# EAGLE board ESP32-Adapter_V101 (EAGLE 9.5.2)
DATUM: 05/2021; VERSION: V1.0.1
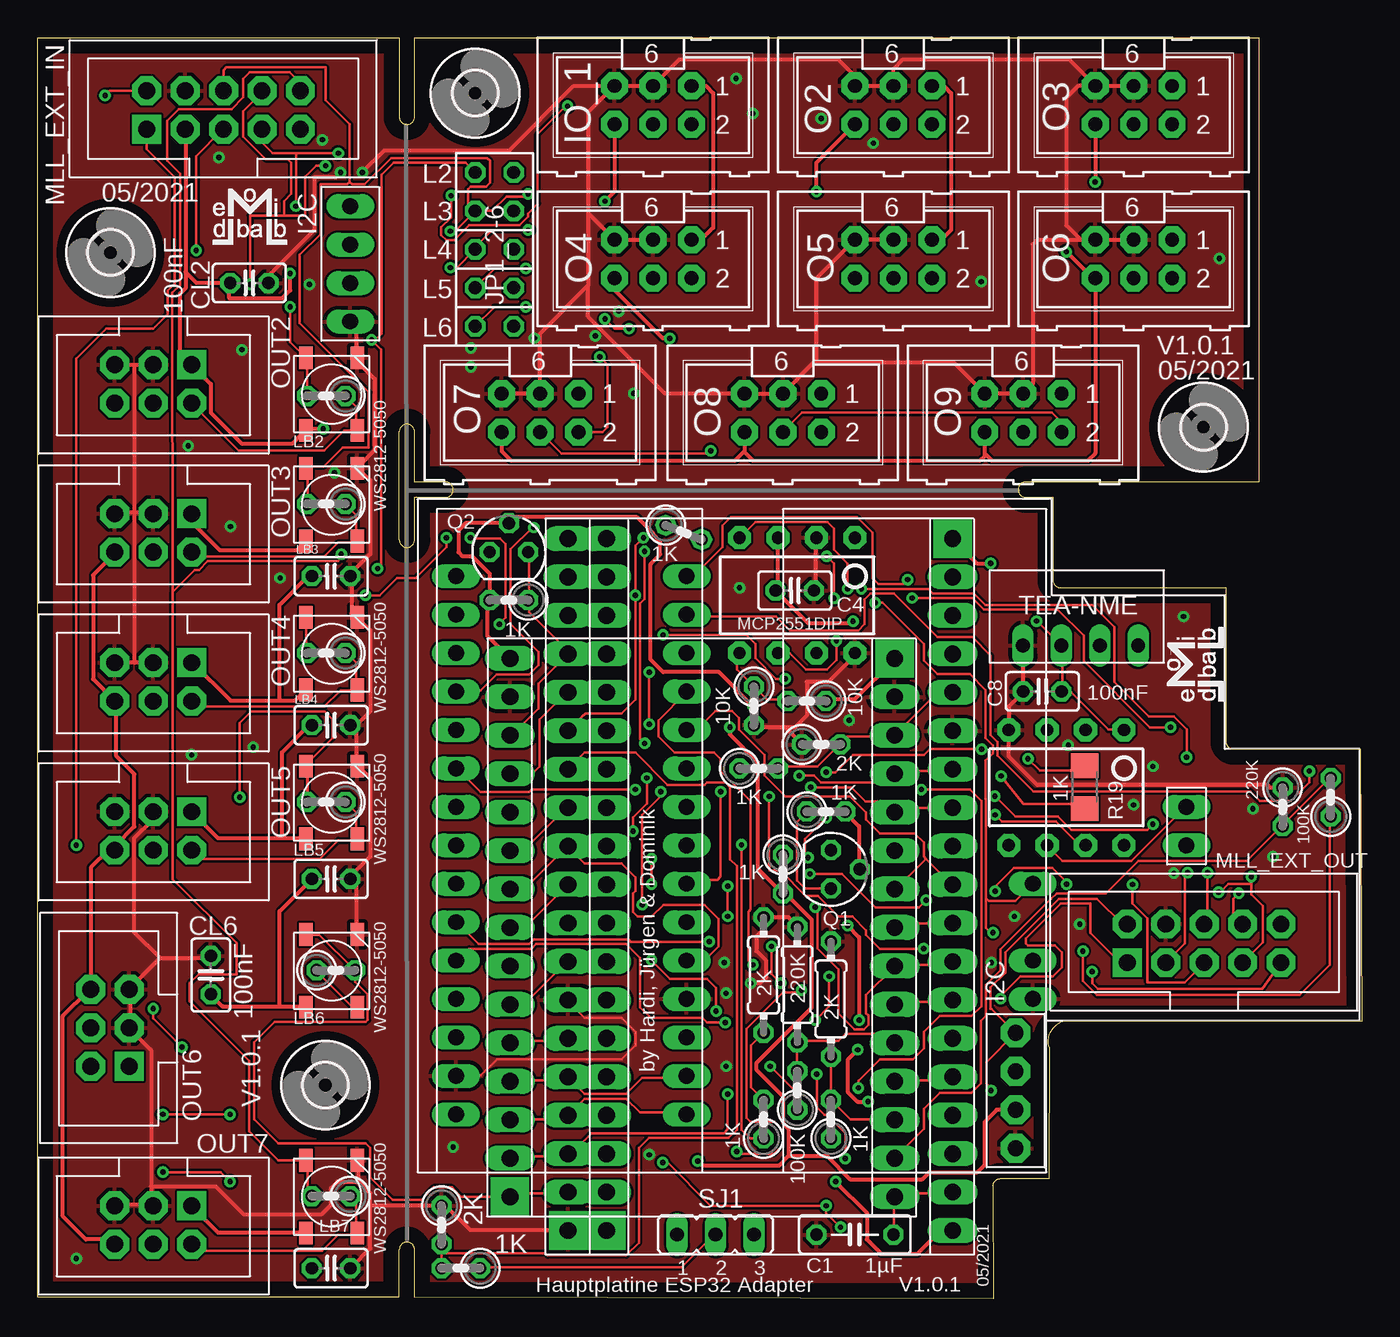
[diagram p2: board, top side]
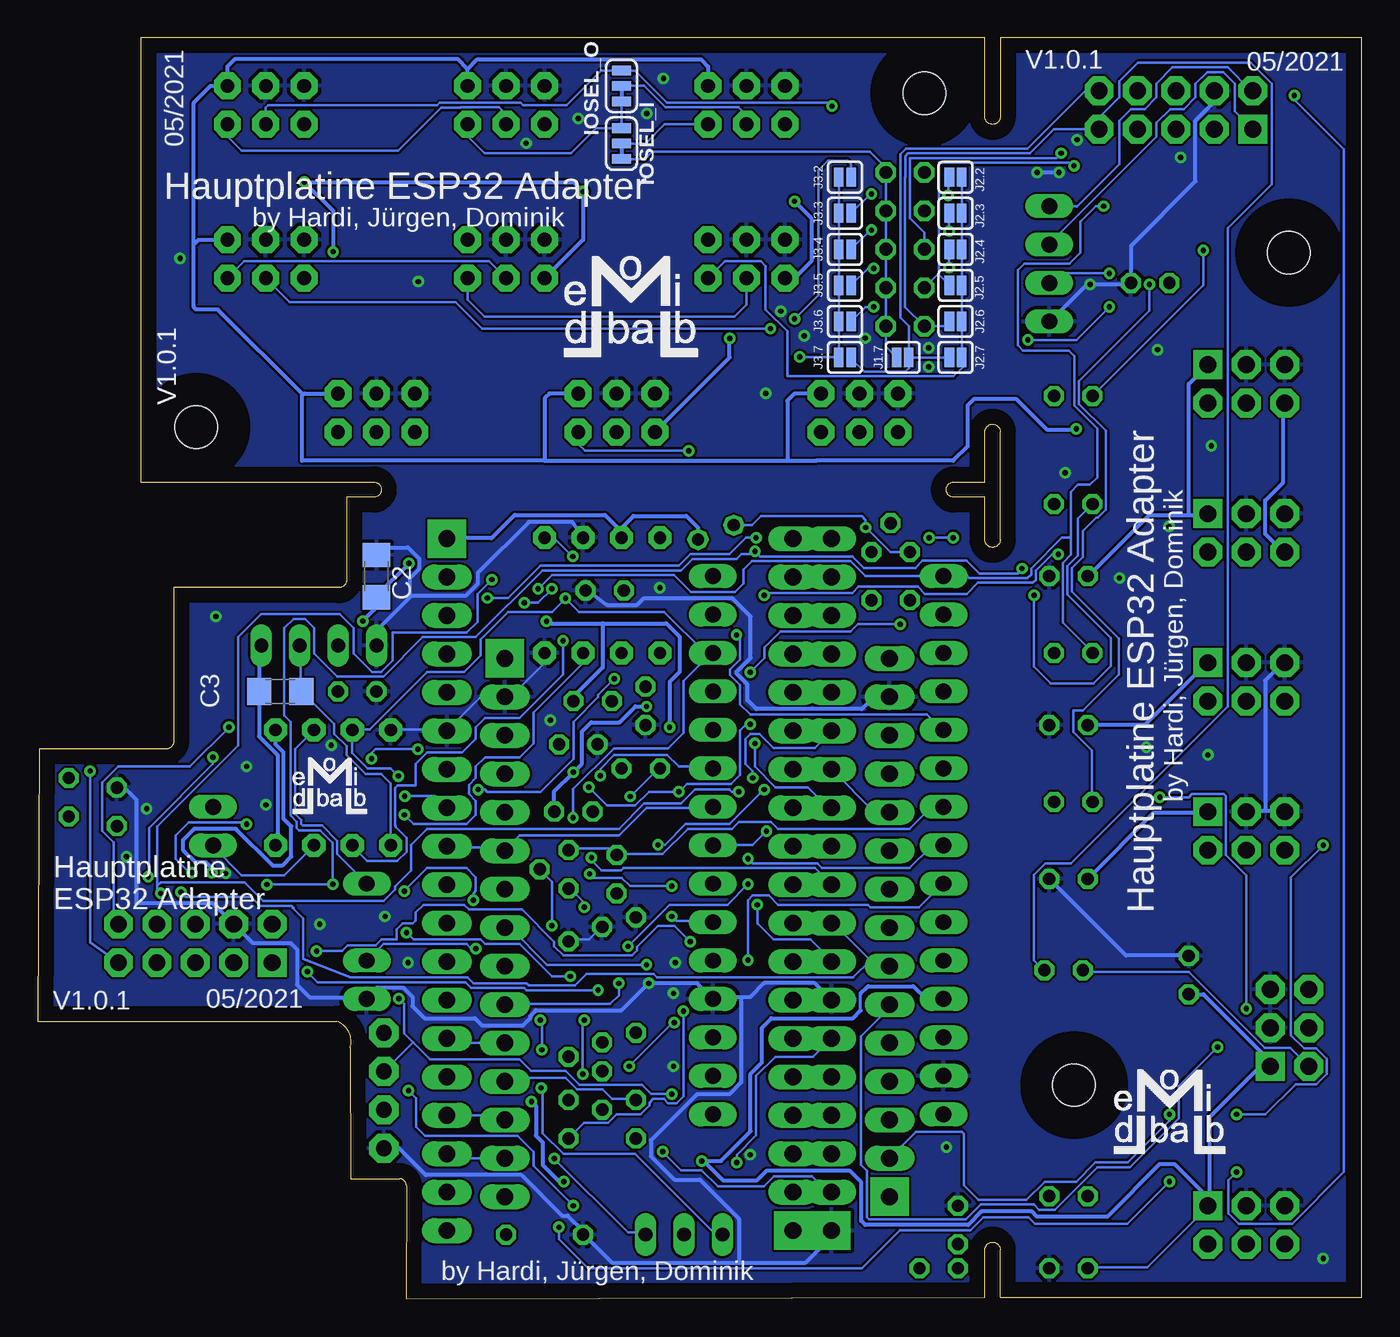
[diagram p3: board, bottom side, seen from below]

Size 87.45 x 83.31 mm. Coordinates in mm from the lower left corner, seen from the top.
Outline: 0,0.13 0,83.31 23.88,83.31 23.88,78.1 arc180 24.89,78.1 24.89,83.31 80.64,83.31 80.64,53.98 65.27,53.98 arc180 65.27,52.96 67.06,52.96 67.06,47.5 arc90 67.56,46.99 78.49,46.99 78.49,36.83 arc90 78.99,36.32 87.38,36.32 87.45,18.34 67.72,18.34 arc90 66.83,16.61 66.8,7.95 63.56,7.95 arc90 63.11,7.47 63.12,0 24.89,0.13 24.89,3.25 arc180 23.88,3.25 23.88,0.13 0,0.13
Outline: 23.88,50.16 arc180 24.89,50.16 24.89,52.96 26.93,52.96 arc180 26.93,53.98 24.89,53.98 24.89,57.29 arc180 23.88,57.29 23.88,50.16
Copper layers (1*16): Top 0.035mm / dielectric 1.5mm / Bottom 0.035mm
Design rules "default *": minimum track width 6mil, minimum drill 0.35mm, track to track 6mil, track to pad 6mil, pad to pad 6mil, via to via 6mil, smd to smd 6mil, copper to edge 40mil, drill to drill 6mil, minimum pad ring 10mil, minimum via ring 8mil, stop-mask expansion 4mil, vias tented up to drill 0.5mm, thermal gap 10mil

## Footprints (pad centres in the part's own frame; a part is rotated, then mirrored left to right if it is on the bottom)
C050-025X075 = drill 0.813 octagon: 1 -2.54,0; 2 2.54,0
C1206 = smd 1.6 x 1.8: 1 -1.4,0; 2 1.4,0
C025-025X050 = drill 0.813 octagon: 1 -1.27,0; 2 1.27,0
2,8 = hole 2.8: 0,0
DIP08 = drill 0.813 pad 1.524 octagon: 1 -3.81,-3.81; 2 -1.27,-3.81; 3 1.27,-3.81; 4 3.81,-3.81; 5 3.81,3.81; 6 1.27,3.81; 7 -1.27,3.81; 8 -3.81,3.81
ML6 = drill 0.914 pad 1.778 octagon: 1 -2.54,-1.27; 2 -2.54,1.27; 3 0,-1.27; 4 0,1.27; 5 2.54,-1.27; 6 2.54,1.27
SMT-JUMPER_3_1-NC_TRACE_SILK = smd 0.635 x 1.27: 1 -1.016,0; 2 0,0; 3 1.016,0
SMT-JUMPER_2_NO_SILK = smd 0.635 x 1.27: 1 -0.406,0; 2 0.406,0
5XJUMPER_L = drill 0.85 pad 1.27 octagon: P$1 -1.27,5.08; P$2 1.27,5.08; P$3 -1.27,2.54; P$4 1.27,2.54; P$5 -1.27,0; P$6 1.27,0; P$7 -1.27,-2.54; P$8 1.27,-2.54; P$9 -1.27,-5.08; P$10 1.27,-5.08
5050 = smd 1.5 x 0.9: DI 2.36,1.66; DO -2.44,-1.74; GND 2.36,-1.74; VCC -2.44,1.66
IDC10 = drill 1.1 pad 1.9 square: 1 -5.08,-1.27 | drill 1.1 pad 1.9 octagon: 2 -5.08,1.27; 3 -2.54,-1.27; 4 -2.54,1.27; 5 0,-1.27; 6 0,1.27; 7 2.54,-1.27; 8 2.54,1.27; 9 5.08,-1.27; 10 5.08,1.27
IDC6 = drill 1.1 pad 1.9 octagon: D1 -2.54,1.27; D2 0,1.27; GND 0,-1.27; GND2 2.54,-1.27; VCC2 2.54,1.27 | drill 1.1 pad 1.9 square: VCC -2.54,-1.27
SOT54E = drill 0.813 octagon: D -1.27,0; G 0,1.905; S 1.27,0
0207/2V = drill 0.813 octagon: 1 -1.27,0; 2 1.27,0
0204/7 = drill 0.813 octagon: 1 -3.81,0; 2 3.81,0
R1206 = smd 1.6 x 1.803: 1 -1.422,0; 2 1.422,0
JP2 = drill 0.914 long: 1 -2.54,0; 2 0,0; 3 2.54,0
ESP32-38D_0 = drill 1.1 pad 1.45 long: CLK 26.887,1.33; CLK-1 24.347,1.33; D0 26.887,14.03; D0-1 24.347,14.03; D2 26.887,11.49; D2-0 24.347,11.49; D4 26.887,16.57; D4-1 24.347,16.57; D5 26.887,24.19; D5-1 24.347,24.19; D12 1.487,16.57; D13 1.487,11.49; D14 1.487,19.11; D15 26.887,8.95; D15-1 24.347,8.95; D16 26.887,19.11; D16-1 24.347,19.11; D17 26.887,21.65; D17-1 24.347,21.65; D18 26.887,26.73; D18-1 24.347,26.73; D19 26.887,29.27; D19-1 24.347,29.27; D21 26.887,34.35; D21-1 24.347,34.35; D22 26.887,41.97; D22-1 24.347,41.97; D23 26.887,44.51; D23-1 24.347,44.51; D25 1.487,26.73; D26 1.487,24.19; D27 1.487,21.65; D32 1.487,31.81; D33 1.487,29.27; D34 1.487,36.89; D35 1.487,34.35; EN 1.487,44.51; GND 1.487,14.03; GND_2 26.887,31.81; GND_2-1 24.347,31.81; RX0 26.887,36.89; RX0-1 24.347,36.89; SD0-1 24.347,3.87; SD1 26.887,6.41; SD1-1 24.347,6.41; SD2 1.487,8.95; SD3 1.487,6.41; SDO 26.887,3.87; TX0 26.887,39.43; TX0-1 24.347,39.43; VCC_2 1.487,47.05; VN 1.487,39.43; VP 1.487,41.97 | drill 1.1 pad 1.27 long: CMD 1.487,3.87 | drill 1.1 pad 2.54 square: GND_3 26.887,47.05; GND_3-1 24.347,47.05; VCC_1 1.487,1.33
ESP32-30_0 = drill 1.1 pad 1.45 long: D2 26.91,8.931; D4 26.91,11.471; D5 26.91,19.091; D12 1.51,8.931; D13 1.51,6.391; D14 1.51,11.471; D15 26.91,6.391; D18 26.91,21.631; D19 26.91,24.171; D21 26.91,26.711; D22 26.91,34.331; D25 1.51,19.091; D26 1.51,16.551; D27 1.51,14.011; D32 1.51,24.171; D33 1.51,21.631; D34 1.51,29.251; D35 1.51,26.711; EN 1.51,36.871; GND 1.51,3.851; GND_2 26.91,3.851; RX0 26.91,29.251; RX2 26.91,14.011; TX0 26.91,31.791; TX2 26.91,16.551; VCC_2 26.91,1.311; VN 1.51,31.791; VP 1.51,34.331 | drill 1.1 pad 2.54 square: D23 26.91,36.871; VCC_1 1.51,1.311
MLL-100-1.2NANOS_CAN = drill 1.05 long: 3V3 1.27,36.83; 5V 1.27,11.43; A0 1.27,31.75; A1 1.27,29.21; A2 1.27,26.67; A3 1.27,24.13; A4 1.27,21.59; A5 1.27,19.05; A6 1.27,16.51; A7 1.27,13.97; AREF 1.27,34.29; CAN_H 49.53,21.59; CAN_L 49.53,24.13; D2 16.51,13.97; D3 16.51,16.51; D4 16.51,19.05; D5 16.51,21.59; D6 16.51,24.13; D7 16.51,26.67; D8 16.51,29.21; D9 16.51,31.75; D10 16.51,34.29; D11 16.51,36.83; D12 16.51,39.37; D13 1.27,39.37; DCC_D2 39.37,13.97; DCC_D4 39.37,19.05; DCC_GND1 39.37,11.43; GND 1.27,6.35; GND1 16.51,11.43; RST 1.27,8.89; RST1 16.51,8.89; RX0 16.51,6.35; TX1 16.51,3.81; VIN 1.27,3.81
I2C-4S = drill 1.05 pad 1.93 octagon: GND 0,-3.81; SCL 0,1.27; SDA 0,3.81; VCC 0,-1.27
DCDC-TEA_NME = drill 0.9 long: G_IN 2.21,1.13; G_OUT 7.29,1.13; V_IN 4.75,1.13; V_OUT 9.83,1.13
I2C-4 = drill 1.05 long: GND 0,-3.81; SCL 0,1.27; SDA 0,3.81; VCC 0,-1.27

## Placement (x,y rotation side)
C1  1µF  [C050-025X075]  53.98,4.25 180 top
C2  4,7µF  [C1206]  65.09,47.75 270 bottom
C3  4,7µF  [C1206]  71.44,40.13 180 bottom
C4  100nF  [C025-025X050]  50.01,46.8 180 top
C8  100nF  [C025-025X050]  66.36,40.13 0 top
CL2  100nF  [C025-025X050]  13.97,67.12 180 top
CL3  100nF  [C025-025X050]  19.37,47.75 180 top
CL4  100nF  [C025-025X050]  19.37,37.91 180 top
CL5  100nF  [C025-025X050]  19.37,27.75 180 top
CL6  100nF  [C025-025X050]  11.43,21.4 270 top
CL7  100nF  [C025-025X050]  19.37,2.03 180 top
H1  MOUNT-HOLE2.8  [2,8]  4.8,69.13 0 top
H2  MOUNT-HOLE2.8  [2,8]  19,14.13 0 top
H3  MOUNT-HOLE2.8  [2,8]  28.89,79.66 0 top
H4  MOUNT-HOLE2.8  [2,8]  76.99,57.59 0 top
IC1  ISO1050  [DIP08]  67.94,33.78 180 top
IO_1  [ML6]  40.64,78.87 180 top
IOSEL_I  JUMPER-SMT_3_1-NC_TRACE_SILK  [SMT-JUMPER_3_1-NC_TRACE_SILK]  48.9,76.33 270 bottom
IOSEL_O  JUMPER-SMT_3_1-NC_TRACE_SILK  [SMT-JUMPER_3_1-NC_TRACE_SILK]  48.9,80.14 270 bottom
J1.7  JUMPER-SMT_2_NO_SILK  [SMT-JUMPER_2_NO_SILK]  30.32,62.2 180 bottom
J2.2  JUMPER-SMT_2_NO_SILK  [SMT-JUMPER_2_NO_SILK]  26.83,74.1 0 bottom
J2.3  JUMPER-SMT_2_NO_SILK  [SMT-JUMPER_2_NO_SILK]  26.83,71.72 0 bottom
J2.4  JUMPER-SMT_2_NO_SILK  [SMT-JUMPER_2_NO_SILK]  26.83,69.34 0 bottom
J2.5  JUMPER-SMT_2_NO_SILK  [SMT-JUMPER_2_NO_SILK]  26.83,66.96 0 bottom
J2.6  JUMPER-SMT_2_NO_SILK  [SMT-JUMPER_2_NO_SILK]  26.83,64.58 0 bottom
J2.7  JUMPER-SMT_2_NO_SILK  [SMT-JUMPER_2_NO_SILK]  26.83,62.2 0 bottom
J3.2  JUMPER-SMT_2_NO_SILK  [SMT-JUMPER_2_NO_SILK]  34.13,74.1 180 bottom
J3.3  JUMPER-SMT_2_NO_SILK  [SMT-JUMPER_2_NO_SILK]  34.13,71.72 180 bottom
J3.4  JUMPER-SMT_2_NO_SILK  [SMT-JUMPER_2_NO_SILK]  34.13,69.34 180 bottom
J3.5  JUMPER-SMT_2_NO_SILK  [SMT-JUMPER_2_NO_SILK]  34.13,66.96 180 bottom
J3.6  JUMPER-SMT_2_NO_SILK  [SMT-JUMPER_2_NO_SILK]  34.13,64.58 180 bottom
J3.7  JUMPER-SMT_2_NO_SILK  [SMT-JUMPER_2_NO_SILK]  34.13,62.2 180 bottom
JP1_2-6  5XJUMPERL  [5XJUMPER_L]  30.16,69.34 0 top
LB2  WS2812-5050  [5050]  19.37,59.82 90 top
LB3  WS2812-5050  [5050]  19.37,52.51 90 top
LB4  WS2812-5050  [5050]  19.37,42.67 90 top
LB5  WS2812-5050  [5050]  19.37,32.83 90 top
LB6  WS2812-5050  [5050]  19.37,21.72 90 top
LB7  WS2812-5050  [5050]  19.37,6.79 90 top
MLL_EXT_IN  MLL-32-EXT10  [IDC10]  12.27,78.55 0 top
MLL_EXT_OUT  MLL-32-EXT10  [IDC10]  77.05,23.49 0 top
O2  [ML6]  56.52,78.87 180 top
O3  [ML6]  72.39,78.87 180 top
O4  [ML6]  40.64,68.71 180 top
O5  [ML6]  56.52,68.71 180 top
O6  [ML6]  72.39,68.71 180 top
O7  [ML6]  33.18,58.55 180 top
O8  [ML6]  49.21,58.55 180 top
O9  [ML6]  65.09,58.55 180 top
OUT2  LED-BUS-OUTPUT  [IDC6]  7.62,60.45 180 top
OUT3  LED-BUS-OUTPUT  [IDC6]  7.62,50.61 180 top
OUT4  LED-BUS-OUTPUT  [IDC6]  7.62,40.77 180 top
OUT5  LED-BUS-OUTPUT  [IDC6]  7.62,30.92 180 top
OUT6  LED-BUS-OUTPUT  [IDC6]  4.76,17.91 90 top
OUT7  LED-BUS-OUTPUT  [IDC6]  7.62,4.89 180 top
Q1  BS170  [SOT54E]  52.39,28.38 270 top
Q2  BS170  [SOT54E]  31.11,49.34 0 top
R1  1K  [0207/2V]  52.07,32.19 0 top
R2  1K  [0207/2V]  49.21,28.07 270 top
R3  1K  [0207/2V]  31.11,46.16 180 top
R4  1K  [0207/2V]  42.66,50.64 338 top
R5  10K  [0207/2V]  47.31,39.18 270 top
R6  1K  [0207/2V]  27.94,2.03 180 top
R7  100K  [0207/2V]  50.16,13.78 90 top
R8  100K  [0207/2V]  85.41,33.15 90 top
R9  1K  [0207/2V]  52.39,11.87 90 top
R10  2K  [0207/2V]  26.67,4.89 270 top
R11  220K  [0204/7]  50.16,20.76 270 top
R12  220K  [0207/2V]  82.23,32.51 270 top
R13  2K  [0204/7]  52.39,19.81 270 top
R14  10K  [0207/2V]  50.8,39.5 180 top
R15  1K  [0207/2V]  47.94,11.87 90 top
R16  2K  [0204/7]  47.94,21.4 270 top
R17  2K  [0207/2V]  51.75,36.64 0 top
R18  1K  [0207/2V]  47.62,35.05 0 top
R19  1K  [R1206]  69.15,33.81 270 top
RL2  100R  [0207/2V]  19.05,59.66 180 top
RL3  100R  [0207/2V]  19.05,52.51 180 top
RL4  100R  [0207/2V]  19.05,42.67 180 top
RL5  100R  [0207/2V]  19.05,32.83 180 top
RL6  100R  [0207/2V]  19.68,21.72 0 top
RL7  100R  [0207/2V]  19.37,6.79 180 top
SJ1  80_CAN  [JP2]  44.77,4.25 0 top
U$1  ESP32-38D_OHNE  [ESP32-38D_0]  61.91,51.56 180 top
U$2  ESP32-30OHNE  [ESP32-30_0]  58.1,43.62 180 top
U$3  MLL-100-NANOS_CAN  [MLL-100-1.2NANOS_CAN]  26.35,8.38 0 top
U$4  I2C  [I2C-4S]  64.59,13.77 0 top
U$5  MCP2551DIP  [DIP08]  50.16,46.48 180 top
U$6  DCDC  [DCDC-TEA_NME]  62.87,42.04 0 top
U$19  I2C  [I2C-4]  20.64,68.39 0 top

## Tracks (layer width: path | path; a pad name or v marks a point on that pad's centre or on a via)
A1_80  (via drill 0.35)
  Top 0.152: v54.2,13.95 54.2,14.4 55.63,15.82 57.82,15.82 58.55,16.55 58.55,17.65 59.6,18.7 61.69,18.7 62.33,19.34 62.33,32.89 61.57,33.66 v58.37,33.66 | v49.38,40.97 48.77,40.97 47.41,42.33 47.41,43.26 46.81,43.87 v41.3,43.87
  Bottom 0.152: v54.2,13.95 54.1,13.84 54.1,10.94 52.73,9.58 48.01,9.58 42.82,4.39 42.37,4.39 SJ1.1 | v58.37,33.66 57.91,33.66 57.76,33.5 54.23,33.5 52.07,35.66 52.07,38.12 50.44,39.75 50.44,39.9 v49.38,40.97 | U$3.A1 27.74,37.62 28.73,38.61 40.39,38.61 41.06,39.28 41.06,40.55 41.74,41.23 41.74,41.57 41.06,42.25 41.06,43.62 v41.3,43.87
A5  (via drill 0.35)
  Top 0.152: v44.81,19.02 44.81,20.56 44.22,21.15 41.76,21.15 v40.54,22.38
  Bottom 0.152: v44.81,19.02 44.81,13.39 45.26,12.93 45.82,12.93 46.1,13.21 46.8,13.21 47.05,12.95 47.05,12.78 47.64,12.19 49.23,12.19 49.8,11.62 51.37,11.62 R9.1 | v40.54,22.38 40.54,26.34 40.23,26.64 39.17,26.64 38.56,26.04 32.61,26.04 32.46,25.88 29.26,25.88 27.74,27.41 U$3.A5
A6_HV  (via drill 0.35)
  Top 0.152: v69.04,22.99 69.04,21.01 69.95,20.09 83.36,20.09 85.34,22.07 85.34,31.83 R8.1 | v44.35,23.6 39.17,23.6 39.01,23.75 32.77,23.75 32.46,23.44 29.11,23.44 27.74,24.82 U$3.A6
  Bottom 0.152: v69.04,22.99 67.36,22.99 66.98,23.37 65.12,23.37 64.74,23.75 63.75,23.75 63.75,24.4 63.34,24.81 62.69,24.81 62.48,25.02 62.48,25.53 61.98,26.04 59.28,26.04 58.98,25.73 55.47,25.73 53.34,23.6 53.34,23.29 52.73,22.68 48.21,22.68 47.86,23.04 47.86,23.26 46.48,24.64 45.39,24.64 v44.35,23.6
A7_HV  (via drill 0.35)
  Top 0.152: v48.39,15.37 50.14,13.61 50.14,12.62 R7.1 | v45.41,18.26 44.2,18.26 43.9,18.56 40.49,18.56 39.79,19.27 39.79,22.52 38.86,23.44 32.92,23.44 32.61,23.14 28.5,23.14 27.74,22.38 U$3.A7
  Bottom 0.152: v48.39,15.37 45.49,18.26 v45.41,18.26
BUT_H  (via drill 0.35)
  Top 0.152: R15.1 47.07,10.6 46.48,11.19 v46.48,30 | v39.47,33.66 32.61,33.66 32.46,33.5 29.26,33.5 27.74,35.03 U$3.A2
  Bottom 0.152: v46.48,30 46.02,30 44.65,31.37 41.76,31.37 v39.47,33.66
BUT_L
  Top 0.152: R16.2 47.12,16.76 47.12,13.97 R15.2 | U$2.D34 56.69,14.45 60.2,14.45 60.35,14.61 U$1.D34
  Bottom 0.152: R15.2 48.01,13.23 49.53,13.23 50.14,13.84 51.82,13.84 52.58,14.61 56.39,14.61 56.54,14.45 U$2.D34
CAN_H  (via drill 0.35)
  Top 0.152: v63.25,31.98 63.68,31.55 67.26,31.55 68.83,29.97 IC1.7
  Bottom 0.152: v63.25,31.98 62.64,31.37 59.13,31.37 58.52,31.98 58.52,32.89 58.98,33.35 58.98,33.96 58.52,34.42 58.52,35.18 57.91,35.79 55.63,35.79 54.71,36.7 54.71,38.73 51.21,42.24 51.21,42.61 U$5.7 | U$3.CAN_H 75.88,29.9 73.98,27.99 71.2,27.99 IC1.7
CAN_L  (via drill 0.35)
  Top 0.152: v52.76,43.48 52.76,42.21 52.13,41.58 50.75,41.58 49.68,42.65 48.93,42.65 U$5.6 | U$3.CAN_L 75.74,32.44 72.24,28.93 67.67,28.93 66.75,29.84 IC1.6
  Bottom 0.152: v52.76,43.48 52.76,41.26 55.63,38.38 57.91,38.38 58.52,37.77 58.52,37.01 59.44,36.09 61.72,36.09 62.48,35.33 62.48,33.93 63.68,33.93 63.85,33.76 63.85,31.27 63.82,31.23 63.82,31.18 63.09,30.45 63.09,29.54 63.7,28.93 65.68,28.93 66.6,29.84 IC1.6
CLOCK_H  (via drill 0.35)
  Top 0.152: U$3.A0 27.74,40.21 29.26,40.21 30.31,41.26 32.45,41.26 33.07,41.88 33.07,42.75 31.24,44.59 31.24,49.53 32.67,50.96 v32.77,50.96
  Bottom 0.152: Q2.D 31.13,49.34 32.75,50.96 v32.77,50.96 32.77,51.47 33.02,51.72 39.69,51.72 40.29,51.12 R4.1
CLOCK_L
  Top 0.152: Q2.S 32.46,49.2 32.46,46.3 R3.1 32.46,46.15 32.46,45.39 34.9,42.95 34.9,42.65 U$1.D15 33.07,40.66 33.07,39.02 31.29,37.23 U$2.D15
D2
  Top 0.152: U$1.D2 34.93,40.07 33.15,38.29 33.15,35.18 32.66,34.69 U$2.D2
D4
  Top 0.152: R10.2 26.67,3.02 | 26.67,3.02 R6.2 | 26.67,3.02 33.53,3.02 33.68,2.87 38.86,2.87 39.71,3.72 39.71,10 40.36,10.64 45.63,10.64 46.18,11.19 46.18,28.59 45.72,29.05 45.72,33.81 45.41,34.11 44.2,34.11 44.04,33.96 41.6,33.96 39.47,36.09 36.12,36.09 35.05,35.03 U$1.D4
  Bottom 0.152: U$2.D4 31.24,32.28 32.31,32.28 34.9,34.87 U$1.D4
D5_CANTX  (via drill 0.35)
  Top 0.152: U$2.D5 31.24,24.66 32.31,24.66 34.9,27.25 U$1.D5 | v52.12,49.05 52.6,48.57 v52.6,46.29 | v50.88,29.16 50.69,29.35 50.69,30.39 v52.09,31.8 | R19.2 68.83,32.7 65.1,32.7 v63.63,34.54
  Bottom 0.152: v52.12,49.05 53.34,50.27 53.96,50.27 U$5.1 | v50.88,29.16 50.88,28.97 50.23,28.32 48.92,28.32 48.77,28.47 36.12,28.47 35.05,27.41 U$1.D5 | v52.09,31.8 52.09,33.68 49.4,36.37 45.82,36.37 44.81,37.39 44.81,40.82 42.98,42.65 U$3.D10 43.36,42.67 46.08,45.39 51.7,45.39 v52.6,46.29 53.49,45.39 56.39,45.39 58.22,43.56 58.22,42.49 59.28,41.43 61.72,41.43 65.53,37.62 66.6,37.62 IC1.3 66.67,36.07 65.66,35.05 64.14,35.05 v63.63,34.54
D13
  Top 0.152: R18.2 48.92,35.18 51.51,35.18 52.88,36.55 R17.2 53.03,36.7 53.49,37.16 56.54,37.16 U$2.D13 56.69,37.31 59.44,40.06 60.35,40.06 U$1.D13
D17
  Top 0.152: U$3.D2 42.98,22.38 44.04,22.38 44.96,23.29 44.96,25.12 44.04,26.04 41.32,26.04 40.55,25.27 39.62,25.27 39.32,25.57 39.32,26.8 39.47,26.95 39.47,27.86 38.56,28.78 36.12,28.78 35.05,29.84 U$1.D17 34.9,29.84 32.16,27.1 31.24,27.1 U$2.TX2
D35
  Top 0.152: R7.2 50.14,15.06 50.14,16.89 R11.2 50.29,17.04 52.88,17.04 53.34,17.5 56.08,17.5 56.54,17.04 U$2.D35
  Bottom 0.152: U$2.D35 60.13,16.91 U$1.D35
D36_VP
  Top 0.152: R8.2 85.34,34.42 82.3,31.37 R12.2 82.14,31.22 79.86,28.93 72.69,28.93 70.56,26.8 67.31,26.8 66.93,26.42 63.6,23.09 63.6,21.71 62.64,20.75 62.64,18.7 62.3,18.37 62.3,14.24 61.69,13.62 59.6,13.62 58.55,12.57 58.55,11.25 U$2.VP
  Bottom 0.152: U$2.VP 60.13,9.29 U$1.VP
D39_VN
  Top 0.152: U$2.VN 56.54,11.86 53.67,11.86 R9.2 R13.2
  Bottom 0.152: U$2.VN 56.89,12.13 U$1.VN
DCC_D2_HV  (via drill 0.35)
  Top 0.152: v48.31,33.2 48.31,28.99 48.33,28.3 49.04,28.3 50.71,26.63 51.52,26.63 52.88,25.27 53.8,25.27 54.71,24.36 54.71,24.05 55.63,23.14 v58.52,23.14
  Bottom 0.152: v48.31,33.2 46.48,35.03 R18.1 | v58.52,23.14 58.83,23.14 59.13,23.44 64.62,23.44 65.68,22.38 U$3.DCC_D2
DI_IO1
  Bottom 0.152: IO_1.2 46.04,77.6 47.31,76.33 IOSEL_I.2
DO1_DI2
  Bottom 0.152: O2.2 59.05,76.8 57.94,75.69 52.23,75.69 50.58,77.34 IOSEL_I.1 | IOSEL_I.1 | IOSEL_O.3 IOSEL_I.1
DO2
  Top 0.152: RL2.1 21.03,58.95 21.03,57.45 LB2.DO 20.24,57.37 18.92,56.06 13.26,56.06 10.21,59.11 OUT2.D1
DO2_DI3
  Bottom 0.152: O3.2 74.93,76.8 73.98,75.85 63.66,75.85 60.8,78.71 59.52,78.71 57,78.71 56.52,78.23 O2.4
DO3
  Top 0.152: RL3.1 20.42,52.4 21.03,51.79 21.03,50.11 LB3.DO 21.03,49.96 19.84,49.96 18.92,49.05 10.36,49.05 10.21,49.2 OUT3.D1
DO4
  Top 0.152: RL4.1 20.42,42.65 21.03,42.04 21.03,40.36 LB4.DO 21.03,40.21 19.99,40.21 18.92,39.14 10.52,39.14 OUT4.D1
DO4_DI5
  Bottom 0.152: O4.4 40.64,65.69 41.43,64.9 57.94,64.9 59.05,66.01 O5.2
DO5
  Top 0.152: RL5.1 20.42,32.74 21.03,32.13 21.03,30.45 LB5.DO 21.03,30.3 19.84,30.3 18.61,29.07 10.68,29.07 10.21,29.54 OUT5.D1
DO5_DI6
  Bottom 0.152: O5.4 57.63,68.55 72.85,68.55 72.86,68.55 73.82,68.55 O6.2
DO6
  Top 0.152: LB6.DO 21.03,19.33 20.73,19.33 18.44,21.61 RL6.1
  Bottom 0.152: RL6.1 18.29,21.61 11.43,21.61 6.4,16.59 4.72,16.59 3.5,15.37 OUT6.D1
DO7
  Top 0.152: RL7.1 20.73,6.68 21.03,6.38 21.03,4.39 LB7.DO 21.03,4.24 19.84,4.24 18.76,3.17 10.52,3.17 10.21,3.48 OUT7.D1
DO7_DI8  (via drill 0.35)
  Top 0.152: O7.4 34.61,55.85 44.45,55.85 v44.45,56.03
  Bottom 0.152: v44.45,56.03 51.3,56.03 51.75,56.48 O8.2
DO8_DI9
  Top 0.152: O8.4 50.48,58.55 66.99,58.55 67.63,57.91 O9.2
DO_IO1_SELECT
  Bottom 0.152: IO_1.4 40.64,78.19 41.17,78.71 46,78.71 47.42,80.14 IOSEL_O.2
EN
  Top 0.152: C1.1 56.54,4.39 56.54,6.68 U$2.EN 56.69,6.83 56.84,6.98 60.35,6.98 U$1.EN
GND  (via drill 0.35)
  Top 0.152: 26.67,6.07 R10.1 | U$3.GND 27.74,14.76 29.26,14.76 30.33,15.82 38.56,15.82 39.47,16.74 39.47,17.65 38.56,18.57 36.12,18.57 35.05,19.63 U$1.GND_2 | 47.4,37.77 R5.2 | 50.44,36.7 R17.1 | 65.08,40.21 C8.1 65.08,40.06 | 64.16,37.62 IC1.4 | 51.38,50.27 U$5.2 | 82.14,33.81 R12.1 | 21.03,24.21 LB6.GND | 20.73,27.71 CL5.1 20.73,27.86 | 21.03,35.33 LB5.GND 21.18,35.18 | 20.71,45.31 LB4.GND 21.18,44.93 | 21.18,54.99 LB3.GND 21.18,54.84 | 20.96,62.07 LB2.GND 21.03,62.33 | 20.73,64.44 U$19.GND | 20.73,47.83 CL3.1 | 5.18,51.94 OUT3.GND2 | 7.62,51.94 OUT3.GND | 5.18,61.7 OUT2.GND2 | 7.62,61.7 OUT2.GND | 21.18,9.12 LB7.GND | 20.73,2.11 CL7.1 | 5.18,6.22 OUT7.GND2 | 7.62,6.22 OUT7.GND 7.32,6.22 | 11.43,22.53 CL6.1 | 6.1,20.55 OUT6.GND2 6.1,20.4 | 6.1,17.96 OUT6.GND 6.1,17.8 | O8.3 46.58,59.82
  Top 0.254: 26.67,6.07 27.05,6.07 28.57,4.55 34.9,4.55 U$1.GND_3 | R11.1 50.14,24.66 49.59,25.21 R16.1 47.94,24.42 47.47,23.94 47.47,22.99 48.1,22.35 48.1,21.24 47.71,20.85 v47.09,20.85 | 49.38,37.77 47.4,37.77 | 50.44,36.7 49.38,37.77 | 65.08,40.21 65.08,43.1 U$6.G_IN | 64.16,37.62 64.16,39.14 65.08,40.06 | C4.1 51.38,46.9 51.38,50.27 | 82.14,33.81 81.38,33.81 81.25,33.94 66.03,33.94 64.14,35.84 IC1.4 | 21.03,24.21 21.03,27.41 20.73,27.71 | 21.03,35.33 21.03,37.47 20.73,37.77 CL4.1 21.04,37.91 21.95,38.82 21.95,44.16 21.18,44.93 | 20.71,45.31 20.71,47.69 CL3.1 | 20.73,27.86 20.73,28 21.95,29.22 21.95,34.41 21.18,35.18 | 21.18,54.99 22.26,56.07 22.26,60.77 20.96,62.07 | 21.03,62.33 21.03,64.13 20.73,64.44 | 20.73,47.83 20.73,47.97 21.95,49.2 21.95,54.07 21.18,54.84 | OUT4.GND 6.38,42.04 | 6.38,42.04 OUT4.GND2 | 7.62,51.94 6.38,51.94 | 6.38,51.94 5.18,51.94 | 7.62,61.7 6.38,61.7 | 6.38,61.7 5.18,61.7 | 6.38,61.7 6.38,51.94 | 6.38,51.94 6.38,42.04 | 21.18,7.75 19.79,7.75 19.37,7.32 19.37,6.22 18.76,5.61 13.6,5.61 11.76,7.44 7.47,7.44 | 21.18,7.75 21.18,9.12 | 21.18,7.75 21.95,6.98 21.95,6.16 | 21.95,6.16 21.95,3.33 20.73,2.11 | 7.62,6.22 7.47,6.22 | 7.47,6.22 7.32,6.22 5.18,6.22 | 8.08,22.53 11.43,22.53 | 6.1,20.55 8.08,22.53 | 6.1,20.4 6.1,17.96 | 7.47,7.44 7.47,16.43 6.1,17.8 | 7.47,7.44 7.47,6.22 | OUT5.GND 7.62,31.69 6.38,30.44 6.38,24.23 8.08,22.53 | R10.1 21.95,6.16 | v21.43,74.42 22.86,75.85 31.11,75.85 35.4,80.14 IO_1.5 | CL2.1 15.24,67.6 18.24,70.6 18.24,74.09 19.67,74.09 v20,74.42 | U$5.8 53.98,42.51 52.23,40.77 50.8,40.77 50.8,38.54 50.02,37.77 49.38,37.77 | IO_1.5 IO_1.3 42.39,81.88 52.86,81.88 53.98,80.77 O2.5 O2.3 56.52,81.25 57.15,81.88 68.1,81.88 O3.5
  Top 0.254: IO_1.5 36.35,78.39 36.35,71.72 | 36.35,71.72 O4.5 O4.3 | 36.35,71.72 36.35,66.96 | O3.5 O3.3 | O3.5 68.74,80.14 67.94,79.34 67.94,70.93 68.9,69.98 | O6.3 O6.5 68.9,69.98 | 68.9,69.98 66.04,69.98 65.72,69.66 65.72,60.45 O9.3 O9.5 60.48,61.88 51.44,61.88 | 36.35,66.96 33.18,63.79 O7.3 O7.5 | 51.44,61.88 51.28,61.88 O8.3 O8.5 46.58,59.82 41.43,59.82 36.35,64.9 36.35,66.96 | 51.44,61.88 51.44,67.44 O5.5 O5.3
  Bottom 0.152: 35.05,4.39 U$1.GND_3 | 51.36,4.24 C1.2 | R13.1 52.27,23.75 51.05,23.75 50.29,24.51 R11.1 | 42.82,19.94 U$3.GND1 42.98,19.94 | 35.05,19.79 U$1.GND_2 | 65.88,19.94 65.77,19.81 U$3.DCC_GND1 | U$5.8 53.8,42.64 53.8,42.19 56.08,39.9 56.54,39.9 U$2.GND 56.69,39.75 58.22,39.75 60.35,37.62 U$1.GND 60.5,37.62 64.01,37.62 IC1.4 | 64.99,49.52 C2.1 | 65.69,19.91 65.68,19.94 | 18.14,67.03 v17.94,67.03 | 15.24,67.03 CL2.1 | 20.57,64.59 U$19.GND | 5.18,42.04 OUT4.GND2 | CL6.1 11.43,22.68
  Bottom 0.203: 65.12,44.13 62.87,46.38 | 64.71,49.64 64.83,49.52
  Bottom 0.254: C1.2 51.44,4.49 52.45,5.5 52.83,5.5 55.51,8.19 61.83,8.19 63.6,9.96 U$4.GND | 35.05,4.39 35.05,4.09 36.73,2.41 41.15,2.41 | 41.15,2.41 49.52,2.41 51.36,4.24 | 41,19.94 40.41,19.94 39.47,20.88 36.14,20.88 35.05,19.79 | 41,19.94 42.82,19.94 | 42.98,19.94 43.89,20.85 v47.09,20.85 47.13,20.85 48.91,19.07 54.56,19.07 54.61,19.02 54.61,18.99 54.91,18.69 54.91,18.56 55.4,18.07 58.1,18.07 58.58,18.54 61.91,18.54 62.71,19.34 62.71,19.97 63.29,20.55 65.07,20.55 65.68,19.94 | R12.1 81.74,33.78 80.93,32.97 80.93,26.13 75.88,26.13 MLL_EXT_OUT.4 73.25,23.51 70.74,23.51 70.33,23.09 70.33,20.76 69.5,19.94 65.88,19.94 | 64.83,49.52 64.99,49.52 | C4.1 51.1,46.8 49.84,45.85 47.85,45.85 47.4,46.3 41.6,46.3 40.37,45.07 40.37,42.35 41.27,41.45 41.27,41.3 40.58,40.6 40.58,39.56 39.98,38.96 33.02,38.96 32.22,39.77 U$2.GND_2 | U$5.2 52.16,51.33 55.01,51.33 58.4,47.95 58.4,47.25 59.15,46.48 62.77,46.48 65.12,44.13 65.08,44.09 U$6.G_IN | 41.15,2.41 41.15,5.31 43.73,7.89 45.41,7.89 46.95,9.42 46.95,10.48 43.9,13.53 41.76,13.53 41,14.3 41,19.94 | v17.94,67.03 15.24,67.03 | 20.57,64.59 18.14,67.03 | MLL_EXT_IN.4 9.75,79.68 9.75,79.07 10.97,77.85 10.97,73.83 15.24,69.56 CL2.1 | 6.38,32.28 7.62,32.28 OUT5.GND | 6.38,32.28 5.18,32.28 OUT5.GND2 | 6.38,32.28 6.38,40.84 5.18,42.04 | v21.43,74.42 v20,74.42 | CL5.1 15.57,22.68 11.43,22.68 | 62.87,46.38 62.87,47.64 62.24,48.27 62.24,48.89 63,49.64 64.71,49.64 | 65.69,19.91 65.69,19.84 U$3.DCC_GND1
  other vias: 39.37,59.82 36.83,63.63 28.6,61.57 28.6,62.84 46.13,80.62 47.22,78.31 51.74,77.98 55.19,76.35 62.31,67.21 78.05,68.73 32.79,63.47 38.38,65.25 18.8,76.58 19.58,54.58 12.73,51.03 9.93,56.36 2.54,2.67 40.39,9.53 45.47,15.37 75.04,28.12 73.66,35.18 75.69,45.09 68.07,36.58 68.83,24.77 64.52,25.27 62.99,22.22 16,47.62 10.16,35.94 14.22,36.45 13.49,62.71 11.96,75.41 80.26,32.39 81.6,29.21 72.39,32.64 53.59,38.23 27.43,10.03 46.35,46.99 45.47,20.19 45.34,22.22
  pour Top: 0,83.34 80.44,83.34 80.44,53.98 67.31,53.98 67.31,47.12 78.74,47.12 78.74,36.12 87.33,36.12 87.33,18.36 66.83,18.36 66.83,8.01 63.06,8.01 63.06,0.13 0,0.13
  pour Bottom: 0,83.34 80.59,83.34 80.59,55.07 79.53,54 67.31,54 67.31,47.12 78.74,47.12 78.74,36.25 87.35,36.25 87.35,18.41 66.8,18.41 66.8,8.01 63.12,8.01 63.12,0.13 0,0.13
GND3
  Bottom 0.152: U$6.G_OUT 70.1,43.1 70.1,40.21 C3.1 69.95,40.06 67.87,37.97 67.87,37.34 67.06,36.53 67.06,35.94 65.79,34.67 64.77,34.67 64.16,34.06 64.16,30 IC1.5
LB#2  (via drill 0.35)
  Top 0.152: v45.57,27.28 v45.57,25.27 | v51,28.08 53.12,28.08 55.32,25.88 58.22,25.88 v58.67,26.34 | v63.25,26.95 63.25,27.25 64.47,28.47 67,28.47 67.97,27.51 v67.97,27.41 | v72.31,27.38 72.31,26.14 73.3,25.15 73.3,20.93 75.75,20.93 MLL_EXT_OUT.5 | v10.46,69.28 10.46,75.51 12.19,77.24 MLL_EXT_IN.5 | v40.08,49.38 40.08,46.23 39.78,45.93 39.78,37.01 v40.08,36.7 | v22.44,48.25 22.69,48.5 22.69,62.72 v22.05,63.36 22.27,63.36 22.7,63.79 22.7,74.26 23.5,75.06 28.26,75.06 JP1_2-6.P$1 | RL2.2 17.78,61.95 LB2.DI 16.67,63.22 v16.67,65.53 | U$2.RX2 31.24,29.69 32.16,29.69 34.9,32.44 U$1.D16
  Bottom 0.152: v45.57,25.27 45.26,24.97 42.94,24.97 U$3.D3 | v45.57,27.28 48.34,27.28 48.88,27.83 50.75,27.83 v51,28.08 | v58.67,26.34 58.67,26.8 58.52,26.95 58.52,27.86 59.13,28.47 61.72,28.47 v63.25,26.95 | v72.31,27.38 67.97,27.38 v67.97,27.41 67.97,30.13 68.81,30.96 70.21,30.96 70.36,31.11 70.36,31.52 70.76,31.93 70.76,38.12 71.17,38.53 71.17,44.32 70.56,44.93 69.8,44.93 69.19,44.32 69.19,42.65 67.67,41.12 64.62,41.12 62.03,43.71 58.52,43.71 54.1,48.13 44.96,48.13 44.2,48.9 41.31,48.9 40.98,49.22 40.24,49.22 v40.08,49.38 39.75,49.05 33.64,49.05 32.88,48.29 29.48,48.29 29,48.77 26.1,48.77 25.26,47.93 22.7,47.93 22.54,48.1 22.54,48.16 v22.44,48.25 | v40.08,36.7 40.08,35.18 38.71,33.81 36.58,33.81 35.22,32.45 U$1.D16 | RL2.2 10.46,66.98 v10.46,69.28 | v22.05,63.36 18.84,63.36 v16.67,65.53
LB#3  (via drill 0.35)
  Top 0.152: v45.11,33.5 45.11,27.91 44.89,27.69 43.12,27.69 U$3.D4 | v51.05,33.81 53.75,33.81 54.67,32.88 55.87,32.88 U$2.D14 56.69,32.28 56.84,32.44 60.35,32.44 U$1.D14 | RL3.2 17.83,52.55 17.83,54.84 LB3.DI 17.83,54.99 18.87,54.99 20.12,56.25 21.86,56.25 21.86,59.89 17.3,64.45 17.3,68.97 18.68,70.35 18.68,73.63 20.44,73.63 20.6,73.79 | MLL_EXT_IN.6 12.27,81.19 12.44,81.36 19.02,81.36 19.02,79.19 20.6,77.6 20.6,73.79 | v40.39,37.97 v40.39,41.4 v40.38,41.4 | v30.48,44.58 30.48,44.59 30.89,45 30.89,49.87 30.53,50.23 28.64,50.23 v28.57,50.29 | v26.99,50.29 26.99,49.66 24.97,47.64 23.74,47.64 22.59,46.48 v21.64,46.48 | 28.81,71.8 JP1_2-6.P$3 30,71.88 30.96,72.83 32.23,72.83 v32.38,72.99 | 28.81,71.8 27.55,70.54 v27.26,70.54 | 20.6,73.79 20.76,73.63 21.59,73.63 23.34,75.38 29.69,75.38 29.86,75.2 29.86,73.75 29.6,73.48 28.57,73.48 28.42,73.32 28.42,72.2 28.81,71.8 | v77.27,28.17 77.27,25.03 MLL_EXT_OUT.6 | v73.66,31.37 73.28,30.99 68.28,30.99 67.39,31.88 64.57,31.88 v63.22,33.22
  Bottom 0.152: v51.05,33.81 49.84,32.59 48.01,32.59 47.09,33.5 v45.11,33.5 44.58,34.04 41.65,34.04 41.06,34.63 41.06,37.55 40.64,37.97 v40.39,37.97 | v40.38,41.4 39.44,42.34 39.44,43.05 38.39,44.1 33.76,44.1 33.28,44.58 v30.48,44.58 | v28.57,50.29 v26.99,50.29 | RL3.2 18.73,51.56 18.73,49.12 19.44,48.41 19.44,46.55 16.57,43.68 16.57,41.83 17.73,40.67 20.53,40.67 21.64,41.78 v21.64,46.48 | v27.26,70.54 27.26,71.7 J2.3.1 | J3.3.1 32.45,72.99 v32.38,72.99 | v77.27,28.17 77.44,28.17 78.35,29.07 78.35,30.61 77.48,31.47 73.76,31.47 v73.66,31.37 | U$1.D14 61.2,33.22 v63.22,33.22
LB#4  (via drill 0.35)
  Top 0.152: v54.41,46.91 58.83,46.91 59.13,46.61 61.85,46.61 62.61,45.85 69.65,45.85 71.12,44.37 71.12,40.77 73.41,38.48 75.03,38.48 75.89,37.62 v75.89,35.79 | MLL_EXT_OUT.7 80.92,23.56 80.92,23.75 80.92,25.97 80.16,26.73 80.16,27 80.16,27.41 | v78,26.87 78.12,26.87 78.65,27.41 80.16,27.41 | 80.16,27.41 v80.16,27.89 | 17.05,75.69 v17.05,72.19 | RL4.2 17.71,42.74 LB4.DI | v19.84,75.69 17.05,75.69 | v27.26,68.13 27.31,68.07 27.62,68.07 JP1_2-6.P$5 28.89,69.5 30,70.61 v32.38,70.61 | 17.05,75.69 15.51,75.69 14.81,76.39 MLL_EXT_IN.7
  Bottom 0.152: 32.46,22.38 34.9,24.82 U$1.D18 | 32.46,22.38 32.16,22.07 31.24,22.07 U$2.D18 32.46,22.38 | v54.41,46.91 53.49,47.83 45.41,47.83 44.3,46.71 41.39,46.71 40.84,47.27 40.84,48.19 40.28,48.75 33.76,48.75 32.77,47.75 U$3.D13 26.04,47.75 25.91,47.62 22.07,47.62 21.83,47.86 21.83,48.26 19.8,50.29 19.21,50.29 | v75.89,35.79 75.89,35.33 80.1,31.13 80.1,27.95 v80.16,27.89 | 32.46,22.38 33.6,21.23 46.56,21.23 46.79,21.46 51.21,21.46 51.97,20.7 55.02,20.7 55.17,20.85 58.67,20.85 59.05,21.23 66.79,21.23 69.91,22.48 69.91,25.15 70.61,25.84 70.55,25.84 70.67,25.97 71.78,25.97 72.77,25.97 73.37,26.57 77.7,26.57 v78,26.87 | RL4.2 17.8,42.73 19.75,44.67 19.75,48.62 19.21,49.16 19.21,50.29 | JP1_2-6.P$5 28.89,70.45 29.84,71.41 29.84,75.38 20.16,75.38 v19.84,75.69 | J2.4.1 27.26,69.32 v27.26,68.13 | J3.4.1 32.45,70.61 v32.38,70.61 | 19.21,50.29 19.21,53.31 18.73,53.78 17.94,53.78 17.46,54.26 17.46,57.49 18.97,59.01 18.97,62.28 19.35,62.66 22.37,62.66 22.71,63 22.71,67.96 22.28,68.4 19.3,68.4 18.57,69.13 18.57,71.18 17.56,72.19 v17.05,72.19
LB#5  (via drill 0.35)
  Top 0.152: U$2.D19 31.24,19.48 32.16,19.48 34.9,22.22 U$1.D19 | U$3.D12 43.32,47.75 45.24,49.68 45.24,51.09 45.8,51.64 54.1,51.64 55.12,50.62 55.12,47.62 55.52,47.22 57.15,47.22 v57.45,47.52 | v79.34,26.8 78.98,26.44 78.98,25.38 MLL_EXT_OUT.8 | v39.93,26.04 39.93,31.98 41.15,33.2 v41.15,33.5 | LB5.DI 17.83,35.18 17.83,32.89 RL5.2 17.78,35.38 19.46,37.07 19.46,38.28 18.94,38.8 14.08,38.8 13.34,38.05 v13.34,33.15 | v14.02,67.03 14.02,71.56 16.26,71.56 | MLL_EXT_IN.8 14.78,79.68 13.56,78.46 13.56,76.78 15.04,75.31 16.49,75.31 16.75,75.06 16.75,73.01 16.26,72.52 16.26,71.56 | v9.53,16.64 7.62,18.54 v7.62,19.18 | 16.26,71.56 17.63,71.56 17.67,71.61 17.67,74.14 18.4,74.86 v19.01,74.86 | v32.23,68.07 30.16,68.07 JP1_2-6.P$7
  Bottom 0.152: v57.45,47.52 58.41,46.57 58.41,44.73 59.12,44.02 64.01,44.02 64.01,42.19 64.77,41.43 65.38,41.43 66.6,42.65 66.6,44.32 67.51,45.24 72.69,45.24 74.22,43.71 74.22,36.55 79.55,31.22 79.55,27.11 | v79.34,26.8 79.55,26.8 79.55,27.11 | v39.93,26.04 39.93,24.82 38.86,23.75 36.42,23.75 35.05,22.38 U$1.D19 | v41.15,33.5 41.6,33.5 41.76,33.66 44.04,33.66 44.96,32.74 47.4,32.74 49.07,31.06 61.72,31.06 62.79,30 62.79,28.32 63.86,27.25 63.86,27.05 64.62,26.29 72.52,26.29 72.58,26.29 73.8,27.51 79.35,27.51 79.55,27.3 79.55,27.11 | RL5.2 17.83,32.89 17.83,36.25 19.05,37.47 19.05,38.86 18.41,38.86 16.03,41.24 16.03,43.64 19.14,46.74 19.14,48.29 18.43,49 18.43,50.72 17.53,51.62 17.41,51.62 16.89,52.15 16.89,57.35 18.67,59.13 18.67,60.65 14.02,65.3 v14.02,67.03 | U$2.D19 31.19,19.23 33.07,17.35 33.07,8.86 32.69,8.48 32.69,5.39 32.56,5.25 26.15,5.25 25.16,6.24 21.66,6.24 21.32,5.91 20.26,5.91 17.45,8.71 15.32,8.71 12.09,11.94 12.09,14.07 v9.53,16.64 | v7.62,19.18 7.62,27.99 8.98,29.35 8.98,33.24 9.12,33.37 11.21,33.37 11.43,33.15 v13.34,33.15 | JP1_2-6.P$7 27.94,67.75 | 27.94,67.75 27.94,67.67 J2.5.1 | 27.94,67.75 27.94,75.06 19.2,75.06 v19.01,74.86 | J3.5.1 32.61,68.07 v32.23,68.07
LB#6  (via drill 0.35)
  Top 0.152: U$1.D23 34.9,6.98 31.39,6.98 31.24,6.83 U$2.D23 27.97,6.75 27.36,7.37 26.15,7.37 25.34,6.56 23.42,6.56 21.95,8.04 21.95,10 21.66,10.29 15.88,10.29 14.29,11.88 14.29,16.95 15.63,18.3 21.65,18.3 21.79,18.43 21.79,20.12 20.95,20.95 RL6.2 20.88,21.77 18.59,24.05 17.83,24.05 LB6.DI | v84,34.87 84,34.11 82.78,32.89 80.73,32.89 80.09,33.53 65.76,33.53 63.4,35.89 63.4,36.8 62.94,37.26 62.94,42.49 61.72,43.71 59.44,43.71 56.54,46.61 55.02,46.61 54.61,46.2 54.61,44.58 54.2,44.17 49.68,44.17 48.77,45.09 42.98,45.09 U$3.D11 | v46.18,9.73 46.33,9.58 48.63,9.58 49.24,10.19 49.24,11.11 48.65,11.69 47.07,11.69 46.81,11.95 46.81,17.83 49.23,20.24 50.29,20.24 v50.44,20.4 | v69.65,21.61 69.65,20.85 70.03,20.47 80.88,20.47 MLL_EXT_OUT.9 | v32.23,65.53 30.16,65.53 JP1_2-6.P$9
  Bottom 0.152: v84,34.87 84,23.56 MLL_EXT_OUT.9 | v50.44,20.4 55.17,20.4 55.32,20.55 58.83,20.55 59.21,20.93 68.96,20.93 v69.65,21.61 | RL6.2 21.03,21.77 21.64,22.38 21.64,28.02 20.88,28.78 19.2,28.78 8.84,39.14 8.84,70.74 5.94,73.64 5.94,80.29 7.32,81.66 14.78,81.66 16,80.44 16,79.38 17.22,78.16 17.22,77.39 MLL_EXT_IN.9 20.32,77.28 21.92,75.68 29.97,75.68 30.15,75.5 30.15,74.12 30.16,74.1 30.16,65.53 JP1_2-6.P$9 27.55,64.26 J2.6.1 | U$1.D23 35.25,7.05 36.3,8.11 38.83,8.11 39.49,7.44 42.53,7.44 43.6,8.51 44.96,8.51 v46.18,9.73 | J3.6.1 32.77,65.53 v32.23,65.53
LB#7  (via drill 0.35)
  Top 0.152: v74.83,37.77 73.46,37.77 69.09,42.14 69.09,43.82 67.36,45.54 62.48,45.54 61.72,46.3 v57.76,46.3 | 36.17,38.68 38.56,38.68 39.47,39.6 v39.47,46.48 39.47,49.76 v40.01,50.29 | 36.17,38.68 36.11,38.62 35.95,38.47 | RL7.2 17.98,6.83 17.83,6.98 17.83,9.12 LB7.DI 15.88,9.15 13.97,11.06 13.97,15.72 10.04,19.65 10.04,20.87 10.62,21.45 13.14,21.45 13.14,23.51 8.91,27.73 8.91,46.72 | 8.91,46.72 8.89,66.48 9.39,66.99 9.39,74.34 8.53,75.2 8.53,77.85 9.3,78.61 12.8,78.61 13.56,79.38 13.56,80.61 14.01,81.05 16.64,81.05 17.35,80.34 MLL_EXT_IN.10 | 8.91,46.72 10.36,48.16 10.65,48.16 11.23,48.74 19.84,48.74 20.04,48.94 v20.04,49.19 | v39.32,30.91 39.32,31.83 40.23,32.74 v40.23,34.42 | U$1.D0 35.95,38.47 | 36.17,38.68 35.95,38.47
  Bottom 0.152: v74.83,37.77 77.42,35.18 82.14,35.18 83.21,34.11 83.21,30.91 82.45,30.15 82.45,25.08 MLL_EXT_OUT.10 | v57.76,46.3 56.39,46.3 54.25,48.44 45.11,48.44 44.35,49.2 41.75,49.2 40.66,50.29 v40.01,50.29 | v39.47,46.48 39.31,46.64 33.66,46.64 33.24,47.05 29.32,47.05 28.84,46.58 26.09,46.58 25.34,47.32 21.7,47.32 21.53,47.5 21.53,48.12 20.45,49.19 v20.04,49.19 | J1.7.1 J2.7.1 | J1.7.1 29.91,64.27 30.47,64.82 30.47,75.61 30.1,75.98 22.09,75.98 18.26,79.82 MLL_EXT_IN.10 | J1.7.1 29.91,61.49 30.15,61.26 32.86,61.26 33.73,62.12 J3.7.1 | v39.32,30.91 40.23,30 42.82,30 U$3.D5 | v40.23,34.42 40.23,34.87 40.69,35.33 40.69,37.01 40.39,37.31 39.78,37.31 38.86,36.4 36.12,36.4 35.03,37.49 U$1.D0
LED#0
  Bottom 0.152: U$3.D6 42.98,32.44 47.24,32.44 49.07,30.61 55.63,30.61 56.54,29.69 U$2.D27 56.69,29.69 56.84,29.84 60.35,29.84 U$1.D27
LED#1  (via drill 0.35)
  Top 0.152: v40.54,27.41 v40.54,29.08 | v48.46,23.29 48.46,21.46 v49.07,20.85 | U$1.D32 60.35,19.63 56.84,19.63 56.69,19.48 U$2.D32
  Bottom 0.152: v40.54,29.08 40.23,28.78 35.97,28.78 35.66,28.47 29.87,28.47 28.5,29.84 27.74,29.84 U$3.A4 | v40.54,27.41 41.91,26.04 45.72,26.04 v48.46,23.29 | v49.07,20.85 49.07,20.06 49.65,19.48 56.54,19.48 U$2.D32
N$1
  Top 0.152: R6.1 29.26,2.11 42.52,2.11 44.65,4.24 SJ1.2
N$7
  Top 0.152: R14.2 49.53,39.6 48.16,39.6 47.4,40.36 R5.1 47.24,40.51 46.18,41.58 46.18,42.64 U$5.5
O3_DO  (via drill 0.35)
  Top 0.152: v27.3,72.89 27.3,71.45 26.65,70.79 26.65,70.29 27.01,69.94 27.51,69.94 28.5,70.93 31.81,70.93 32.37,71.49 32.37,71.71 33.02,72.36 33.02,76.96 34.92,78.87 v34.99,78.8
  Bottom 0.152: J2.2.1 27.3,74.03 v27.3,72.89 | v34.99,78.8 35.21,79.02 45.87,79.02 48.01,81.15 IOSEL_O.1 50.26,81.15 52.54,78.87 54.28,78.87 54.29,78.87 55.4,78.87 55.56,79.02 60.92,79.02 61.07,78.87 72.23,78.87 72.39,78.71 O3.4
O6_DO  (via drill 0.35)
  Top 0.152: v37.47,64.74 38.1,64.1 v39.05,64.1
  Bottom 0.152: O6.4 70.8,65.85 59.85,65.85 58.1,64.1 v39.05,64.1 | J3.2.1 33.73,74.96 33.97,75.21 35.24,75.21 35.88,74.57 35.88,66.33 v37.47,64.74
PWR2  (via drill 0.35)
  Top 0.254: v67.94,69.18 69.69,67.44 O6.6 69.85,55.85 69.37,55.37 63.02,55.37 62.55,55.85 | v37.47,72.52 38.1,73.15 IO_1.6 | v51.44,73.15 51.44,75.06 O2.6 | O7.6 30.64,56.01 31.27,55.37 46.04,55.37 46.67,56.01 O8.6 46.67,55.93 47.23,55.37 62.23,55.37 62.55,55.69 62.55,55.85 | 62.55,55.85 O9.6 | v41.75,63.47 41.27,63.47 38.1,66.64 O4.6 | O3.6 v69.85,73.79
  Bottom 0.254: v67.94,69.18 67.94,71.88 v69.85,73.79 52.07,73.79 v51.44,73.15 51.44,69.98 O5.6 | v37.47,72.52 36.35,71.41 36.35,68.55 37.47,67.44 O4.6 | O8.6 41.75,62.2 v41.75,63.47
RESET
  Bottom 0.152: Q1.D 52.27,29.77 49.47,29.77 49.47,29.32 49.23,29.32 R2.1 49.07,29.39 46.18,29.39 44.5,31.06 41.6,31.06 41.15,31.52 39.01,31.52 38.56,31.06 29.87,31.06 28.5,32.44 27.74,32.44 U$3.A3
RESET_K_L  (via drill 0.35)
  Top 0.152: U$1.D33 60.35,22.22 60.2,22.07 56.69,22.07 U$2.D33 56.54,21.92 54.71,20.09 54.71,18.87 54.86,18.72 54.86,18.11 54.56,17.8 53.95,17.8 52.88,18.87 52.88,21.77 51.49,23.16 51.49,25.76 v51.36,25.88 | Q1.S 52.38,27.13 50.66,27.13 50.14,27.65 50.14,31.52 50.75,32.13 R1.1
  Bottom 0.152: v51.36,25.88 51.36,26.19 52.27,27.1 Q1.S
RX0
  Top 0.152: U$3.RX0 42.82,14.61 39.93,14.61 38.86,13.54 36.12,13.54 35.05,14.61 U$1.RX0 34.9,14.61 34.75,14.45 31.24,14.45 U$2.RX0
SCL  (via drill 0.35)
  Top 0.152: U$2.D22 31.24,9.42 34.75,9.42 34.9,9.58 U$1.D22 35.05,9.73 35.36,9.73 36.58,10.95 45.32,10.95 45.57,11.2 v45.57,13.54 | v63.6,19.84 63.6,19.99 64.92,21.31 67.06,21.31 67.64,21.89 67.64,22.91 67.18,23.37 65.41,23.37 65.28,23.49 65.28,23.83 67.59,26.14 69.53,26.14 69.53,24.18 71.48,22.22 MLL_EXT_OUT.1 | v2.54,29.97 2.54,62.12 4.52,64.1 7.62,64.1 8.59,65.07 8.59,66.61 9.05,67.07 9.05,74.1 7.19,75.96 MLL_EXT_IN.1 | v8.26,12.19 v12.7,12.19
  Bottom 0.152: U$19.SCL 20.57,69.77 13.56,76.78 13.56,77.7 12.65,78.61 11.73,78.61 10.97,79.38 10.97,80.29 10.21,81.05 9.14,81.05 8.38,80.29 8.38,78.46 7.32,77.39 MLL_EXT_IN.1 | 62.67,16.95 64.48,15.14 64.48,15.04 U$4.SCL | v63.6,19.84 63.27,19.51 63.27,17.54 63.27,17.55 62.67,16.95 | v45.57,13.54 46.94,13.54 47.55,14.15 51.66,14.15 52.58,15.06 54.86,15.06 55.63,15.82 61.54,15.82 62.67,16.95 | v2.54,29.97 4.67,27.84 4.67,17.42 3.8,16.55 3,16.55 2.31,15.86 2.31,14.88 3,14.19 4.35,14.19 6.35,12.19 v8.26,12.19 | v12.7,12.19 12.7,11.77 15.45,9.02 17.58,9.02 18.85,7.75 20.94,7.75 22.14,6.55 25.33,6.55 26.29,7.5 26.29,10.92 26.42,11.05 29.44,11.05 U$2.D22
SDA_D21  (via drill 0.35)
  Top 0.152: U$2.D21 31.24,17.04 34.75,17.04 34.9,17.2 U$1.D21 | MLL_EXT_OUT.2 71.63,24.77 69.95,26.44 67.46,26.44 63.91,22.88 63.91,21.53 62.94,20.57 62.94,19.16 63.01,19.16 U$4.SDA 62.65,15.63 62.65,14.24 62.96,13.92 v62.96,13.77 | v53.02,4.74 52.07,5.69 v52.07,6.16 44.45,6.16 41.59,9.02 v41.27,9.02 | v12.7,7.75 12.06,8.38 v8.26,8.38 | v4.45,79.5 4.76,79.82 MLL_EXT_IN.2
  Bottom 0.152: U$19.SDA 18.84,72.2 18.83,72.16 16,74.98 16,77.85 15.24,78.61 14.33,78.61 13.56,79.38 13.56,80.29 12.5,81.36 8.84,81.36 7.32,79.83 MLL_EXT_IN.2 | v53.02,4.74 53.02,3.94 51.12,2.03 33.02,2.03 30.51,4.54 25.84,4.54 24.98,5.4 22,5.4 21.58,4.98 15.47,4.98 v12.7,7.75 | v52.07,6.16 54.71,8.8 54.71,9.73 55.76,10.78 61.87,10.78 62.46,11.38 62.46,13.27 v62.96,13.77 | v8.26,8.38 8.8,7.84 8.8,5.67 8.11,4.98 4.59,4.98 1.17,8.41 1.17,75.94 4.45,79.22 v4.45,79.5 | v41.27,9.02 41.27,9.53 40.01,10.79 40.01,14.73 38.73,16 36.24,16 U$1.D21
SEL1
  Bottom 0.152: J1.7.2 31.43,62.9 JP1_2-6.P$10 JP1_2-6.P$8 JP1_2-6.P$6 JP1_2-6.P$4 JP1_2-6.P$2 31.43,74.74 32.47,75.77 46.86,75.77 47.33,75.31 IOSEL_I.3
SEL2
  Bottom 0.152: J2.2.2 J2.3.2 J2.4.2 J2.5.2 J2.6.2 J2.7.2 26.35,62.13 26.35,61.56 26.96,60.95 37.94,60.95 37.94,63.95 39.37,65.37 39.37,68.23 39.69,68.55 42.06,68.55 O4.2
SEL3  (via drill 0.35)
  Top 0.152: v37.12,62.23 37.62,61.72 37.62,57.6 37.31,57.28 O7.2
  Bottom 0.152: J3.2.2 J3.3.2 J3.4.2 J3.5.2 J3.6.2 J3.7.2 34.57,62.23 v37.12,62.23
SWLEFT  (via drill 0.35)
  Top 0.152: U$1.D12 60.35,34.87 56.84,34.87 56.69,34.72 U$2.D12 56.55,34.6 56.06,34.11 51.74,34.11 51.28,34.57 v50.29,34.57
  Bottom 0.152: v50.29,34.57 50.29,35.03 49.38,35.94 45.87,35.94 45.11,35.18 42.98,35.18 U$3.D7
SWMIDDLE
  Top 0.152: 58.67,29.08 60.35,27.41 U$1.D26 | 58.67,29.08 58.52,29.23 58.52,30.15 57.91,30.76 55.63,30.76 54.71,31.67 54.71,32.13 53.65,33.2 49.38,33.2 48.01,34.57 48.01,35.94 46.33,37.62 46.33,38.39 45.87,38.86 44.78,38.86 43.54,37.62 42.98,37.62 U$3.D8 | 58.67,29.08 56.69,27.1 U$2.D26
SWRIGHT  (via drill 0.35)
  Top 0.152: v47.24,22.07 46.94,22.38 46.94,25.58 47.09,25.73 47.09,32.89 45.1,34.89 45.1,35.67 44.67,36.09 42.06,36.09 41,37.16 41,38.23 42.82,40.06 U$3.D9 | U$1.D25 60.35,24.82 56.84,24.82 56.69,24.66 U$2.D25
  Bottom 0.152: v47.24,22.07 53.8,22.07 56.24,24.51 56.54,24.51 U$2.D25
SX_D4  (via drill 0.35)
  Top 0.152: v53.34,9.27 53.34,10.95 52.12,12.17 51.97,12.17 51.46,12.68 v51.46,14.86 | v52.27,21.31 52.27,19.33 v51.36,18.41 | v53.49,46.91 53.49,48.59 52.58,49.51 52.58,50.9 52.15,51.33 47.4,51.33 U$5.4 | v55.32,46 55.78,46 58.52,43.26 58.52,42.19 59.44,41.28 61.57,41.28 62.61,40.23 62.61,37.05 63.09,36.57 63.09,36.04 62.61,35.56 62.61,33.05 62.64,33.02 62.64,26.49 | U$3.DCC_D4 64.58,26.29 62.84,26.29 62.64,26.49 | 62.64,26.49 62.64,24.51 62.94,24.21 v63.09,24.21
  Bottom 0.152: v53.34,9.27 48.46,4.39 47.4,4.39 SJ1.3 | v51.36,18.41 51.46,18.31 v51.46,14.86 | v52.27,21.31 53.49,21.31 55.63,23.44 57.91,23.44 58.22,23.75 62.64,23.75 v63.09,24.21 | IC1.2 70.46,36.35 70.46,32.05 70.05,31.65 70.05,31.37 69.95,31.27 68.68,31.27 67.67,30.25 67.67,29.39 65.84,27.56 U$3.DCC_D4 | v53.49,46.91 54.41,46 v55.32,46
TX0
  Top 0.152: U$3.TX1 42.82,12.32 39.78,12.32 38.86,13.23 36.12,13.23 35.05,12.17 U$1.TX0 34.9,12.01 34.75,11.86 31.24,11.86 U$2.TX0
VCC2
  Top 0.152: 3.5,20.55 OUT6.VCC2 3.35,20.4 | 5.18,39.45 OUT4.VCC2
  Top 0.254: OUT4.VCC2 5.06,39.54 3.65,40.95 3.65,47.82 5.03,49.2 OUT3.VCC2 | 3.5,20.55 3.5,28.49 4.67,29.65 OUT5.VCC2 5.08,29.91 6.38,31.2 6.38,34.68 5.18,35.87 5.18,39.45 | 3.35,20.4 1.65,18.69 1.65,5.46 3.17,3.94 4.76,3.94 OUT7.VCC2
  Bottom 0.152: 5.18,49.35 OUT3.VCC2
  Bottom 0.254: 5.18,49.35 6.38,50.55 6.38,52.75 5.18,53.94 5.18,59.11 OUT2.VCC2
VCC3
  Bottom 0.152: 72.85,40.21 C3.2 72.85,40.06
  Bottom 0.254: 72.85,40.21 72.85,43.1 U$6.V_OUT | IC1.8 71.62,30.11 71.62,35.94 72.85,37.16 72.85,40.06
VCC_1  (via drill 0.35)
  Top 0.152: 49.38,26.8 R2.2 49.07,26.8 49.07,26.92 | v65.99,44.78 67.51,43.26 U$6.V_IN 67.67,43.1 67.67,40.21 C8.2 67.67,40.06 68.28,40.06 70.71,37.62 71.63,37.62 71.66,37.61 IC1.1 | v75.96,28.16 75.77,27.96 75.77,23.48 MLL_EXT_OUT.3 | 60.5,50.11 U$1.VCC_1 | 17.44,57.13 LB2.VCC 17.65,57.48 | 12.65,67.03 CL2.2 | 9.75,77.24 MLL_EXT_IN.3 | 17.68,30.45 LB5.VCC | 10.21,32.13 OUT5.VCC | CL4.2 17.93,37.91 | 10.21,42.04 OUT4.VCC | 17.68,4.39 LB7.VCC | 10.21,6.07 OUT7.VCC | 17.68,19.33 LB6.VCC | 11.43,20.09 CL6.2 | 17.98,27.63 17.98,27.71 CL5.2
  Top 0.254: 49.38,26.8 51.13,25.05 51.13,19.25 47.48,15.61 47.48,15.13 49.23,13.39 49.23,11.62 49.59,11.25 49.59,9.45 | v43.59,9.12 43.9,8.8 48.95,8.8 49.59,9.45 | R14.1 52.12,39.6 53.95,39.6 56.54,42.19 U$2.VCC_1 | v62.94,48.59 62.03,48.59 60.5,50.11 | 49.07,26.92 47.55,28.43 47.55,35.46 45.72,37.29 v45.72,37.77 | 12.65,67.03 12.65,66.12 16.14,66.12 16.67,66.64 v16.67,67.75 | 9.75,77.24 9.75,67.85 | CL2.2 10.49,67.12 9.75,67.85 | 16.13,30.45 11.89,30.45 10.21,32.13 | 16.13,30.45 17.68,30.45 | 17.93,37.91 16.13,36.11 16.13,30.45 | LB3.VCC 17.09,49.45 12.04,49.45 10.16,51.33 OUT3.VCC | 10.21,42.04 12.72,39.52 16,39.52 | CL3.2 17.87,47.75 15.97,45.85 15.97,39.55 16,39.52 | 17.68,4.39 11.89,4.39 10.21,6.07 | 15.96,19.33 12.19,19.33 11.43,20.09 | 15.96,19.33 17.68,19.33 | 17.98,27.63 15.96,25.61 15.96,19.33 | U$5.3 48.9,46.96 C4.2 50.88,44.65 53.72,44.65 v53.84,44.78 v53.85,44.78 | v18.85,57.48 17.65,57.48 | 49.59,9.45 52.11,9.45 53.66,7.91 58.42,7.91 58.9,8.38 62.07,8.38 62.55,8.86 62.55,11.7 63.35,12.5 U$4.VCC | O2.1 59.85,80.14 60.33,79.66 60.33,70.61 59.69,69.98 O5.1 | IO_1.1 44.13,80.14 44.61,79.66 44.61,70.77 43.81,69.98 O4.1 | 16,39.52 17,39.52 LB4.VCC | 9.75,67.85 9.75,66.78 9.4,66.42 9.4,62.48 OUT2.VCC 11.43,60.45 11.43,58.55 13.46,56.52 16.83,56.52 17.44,57.13
  Bottom 0.152: 65.23,45.54 65.23,46.3 C2.2 65.08,46.46 | 60.35,50.27 U$1.VCC_1 | 10.21,51.79 OUT3.VCC | 17.98,47.83 CL3.2 | 17.98,37.92 CL4.2 | 10.21,42.04 OUT4.VCC | CL7.2 17.98,2.11 14.17,2.11 10.21,6.07 OUT7.VCC 10.06,6.22 | 10.21,32.13 OUT5.VCC | OUT6.VCC 6.71,15.37 | v16.67,67.75 20,67.75 U$19.VCC | 18.89,57.44 v18.85,57.48 | 36.04,55.37 36.05,55.35
  Bottom 0.203: 33.1,19.05 33.1,20.18
  Bottom 0.254: v65.99,44.78 65.23,45.54 | 60.35,50.27 57.48,50.27 55.95,51.8 49.99,51.8 48.9,50.7 U$5.3 48.9,50.93 48.1,51.72 44.61,51.72 43.84,50.95 R4.2 | 50.15,44.62 50.15,41.71 51.97,39.88 51.97,39.6 R14.1 | v62.94,48.59 65.08,46.46 | 11.43,51.79 14.02,51.79 17.98,47.83 | 11.43,51.79 10.21,51.79 | 17.98,37.92 14.33,37.92 10.21,42.04 | CL6.2 10.45,20.13 6.2,15.88 6.71,15.37 10.06,12.01 10.06,6.22 | 10.21,32.13 13.72,32.13 CL5.2 | OUT7.VCC 10.16,6.7 12.38,8.93 13.33,8.93 16.82,5.44 21.45,5.44 21.79,5.78 25.11,5.78 25.99,4.9 32.79,4.9 33.05,5.15 33.05,7.71 33.8,8.46 39.32,8.46 39.94,7.84 42.19,7.84 43.47,9.12 v43.59,9.12 42.32,9.12 40.36,11.07 40.36,14.88 39.62,15.62 39.62,17.91 38.99,18.54 33.6,18.54 33.1,19.05 | U$3.5V 28.76,19.81 29.61,20.67 32.61,20.67 33.1,20.18 | 18.89,57.44 20.8,57.44 22.8,59.44 25.63,59.44 26.04,59.03 26.04,56.32 26.99,55.37 36.04,55.37 | v75.96,28.16 75.88,28.23 75.88,28.38 76.36,28.86 77.07,28.86 77.88,29.68 77.88,30.3 77.11,31.06 74.37,31.06 71.92,28.61 71.32,28.61 70.71,29.22 70.71,31.22 71.22,31.72 71.22,36.1 71.75,36.64 IC1.1 | v45.72,37.77 45.72,40.77 45.05,41.43 45.05,43.75 45.92,44.62 50.15,44.62 | 37.92,55.35 37.94,55.37 37.94,59.34 37.47,59.82 O7.1 | 36.05,55.35 37.92,55.35 | 37.92,55.35 53.96,55.35 53.98,55.37 | 53.98,55.37 70.01,55.37 70.01,59.66 69.93,59.74 | 69.93,59.74 69.85,59.82 O9.1 | 69.93,59.74 75.56,65.37 76.99,65.37 77.15,65.53 77.15,69.66 | 77.15,69.66 76.83,69.98 O6.1 | 77.15,69.66 77.15,79.03 76.04,80.14 O3.1 74.93,81.41 74.45,81.88 59.69,81.88 59.05,81.25 | O2.1 59.05,81.25 | 59.05,81.25 58.42,81.88 43.66,81.88 43.18,81.41 IO_1.1
  Bottom 0.254: O8.1 53.66,59.82 53.98,59.5 53.98,55.37 | OUT2.VCC 11.43,60.45 11.43,51.79 | v53.85,44.78 53.69,44.62 50.15,44.62
VCC_2  (via drill 0.35)
  Top 0.152: 54.25,28.47 Q1.G | 53.34,32.13 R1.2 | R19.1 68.83,34.91 66.18,34.91 v65.41,35.69 | v62.36,36.32 58.93,36.32 58.55,35.94 53.85,35.94 52.7,34.8 v52.07,34.8
  Top 0.254: 54.25,28.47 54.25,31.22 53.34,32.13 | v54.84,13.03 54.15,13.03 53.49,13.69 53.49,15.79 v54.15,16.46 | v54.25,18.41 54.25,23.9 v53.49,24.66 | U$2.VCC_2 29.69,43.82 29.69,46.01 R3.2 29.84,47.91 28.67,49.09 28.04,49.09 27.78,49.34 27.78,50.77 28.26,51.24 Q2.G 31.52,51.65 39.58,51.65 40.66,50.56 40.66,50.49 41.12,50.04 41.12,49.18 40.48,48.55 40.48,42.23 41.31,41.4 44.98,41.4 v47.24,39.14 | v52.7,7.75 54.77,5.68 54.77,3.94 55.72,2.98 58.1,2.98 59.63,4.51 U$1.VCC_2
  Bottom 0.152: v54.15,16.46 54.15,18.31 v54.25,18.41 | v53.49,24.66 53.49,27.56 54.25,28.32 Q1.G | v65.41,35.69 65.41,36.07 65.15,36.32 v62.36,36.32
  Bottom 0.254: v54.84,13.03 54.55,12.74 54.55,10.78 54.11,10.34 54.11,8.86 52.99,7.75 v52.7,7.75 | v47.24,39.14 47.98,39.14 49.03,38.09 50.9,38.09 51.51,37.48 51.51,35.36 v52.07,34.8 53.34,33.53 R1.2

## Text on the board
tPlace: by Hardi, Jürgen & Dominik | Hauptplatine ESP32 Adapter | C:/Users/Jürgen/Documents/Arduino/MLL_IconBW5.bmp | C:/Users/Jürgen/Documents/Arduino/MLL_IconBW5.bmp | C:/Users/Jürgen/Documents/Arduino/MLL_IconBW5.bmp | C:/Users/Jürgen/Documents/Arduino/MLL_IconBW5.bmp
bPlace: Hauptplatine ESP32 Adapter | by Hardi, Jürgen, Dominik | Hauptplatine ESP32 Adapter | by Hardi, Jürgen, Dominik | Hauptplatine / ESP32 Adapter | by Hardi, Jürgen, Dominik